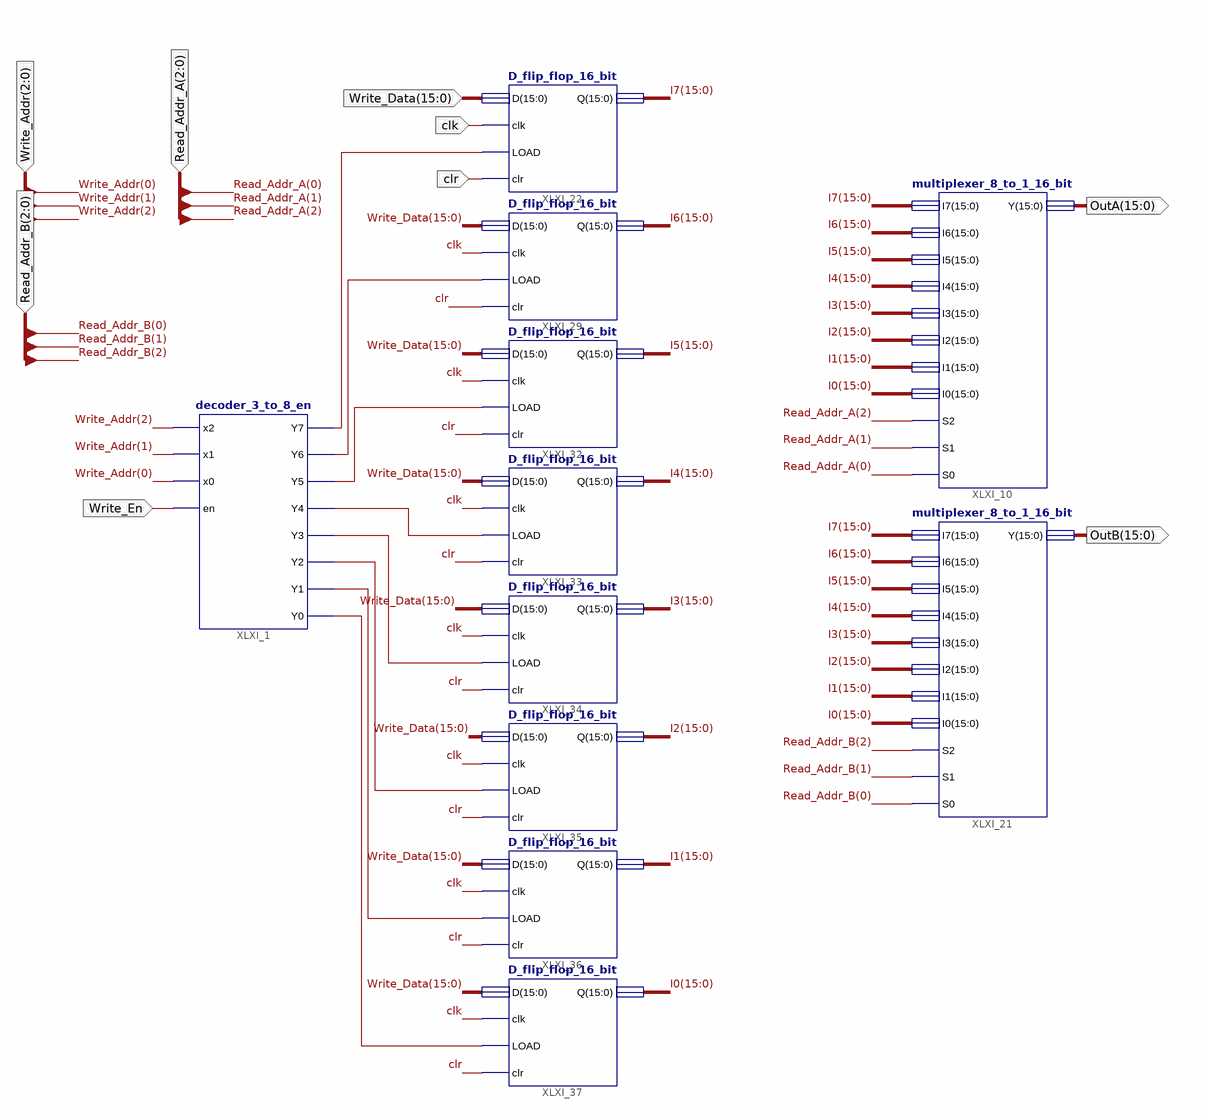
[diagram p0: schematic sheet 1]
// Xilinx ISE schematic register_file_16_bit.sch (virtex6) as structural Verilog: 11 symbols, 9 ports
module register_file_16_bit (
  input  Write_En,
  input  [2:0] Write_Addr,
  input  clk,
  input  [2:0] Read_Addr_A,
  input  [2:0] Read_Addr_B,
  input  [15:0] Write_Data,
  input  clr,
  output [15:0] OutA,
  output [15:0] OutB
);

  wire XLXN_101, XLXN_102, XLXN_103, XLXN_104, XLXN_105, XLXN_107, XLXN_109, XLXN_111;
  wire [15:0] I0, I1, I2, I3, I4, I5, I6, I7;

  decoder_3_to_8_en XLXI_1 (
    .en(Write_En), .x0(Write_Addr[0]), .x1(Write_Addr[1]), .x2(Write_Addr[2]), .Y0(XLXN_111), .Y1(XLXN_109),
    .Y2(XLXN_107), .Y3(XLXN_105), .Y4(XLXN_104), .Y5(XLXN_103), .Y6(XLXN_102), .Y7(XLXN_101));
  multiplexer_8_to_1_16_bit XLXI_10 (
    .I0(I0), .I1(I1), .I2(I2), .I3(I3), .I4(I4), .I5(I5), .I6(I6), .I7(I7), .S0(Read_Addr_A[0]),
    .S1(Read_Addr_A[1]), .S2(Read_Addr_A[2]), .Y(OutA));
  multiplexer_8_to_1_16_bit XLXI_21 (
    .I0(I0), .I1(I1), .I2(I2), .I3(I3), .I4(I4), .I5(I5), .I6(I6), .I7(I7), .S0(Read_Addr_B[0]),
    .S1(Read_Addr_B[1]), .S2(Read_Addr_B[2]), .Y(OutB));
  D_flip_flop_16_bit XLXI_22 (.clk(clk), .clr(clr), .D(Write_Data), .LOAD(XLXN_101), .Q(I7));
  D_flip_flop_16_bit XLXI_29 (.clk(clk), .clr(clr), .D(Write_Data), .LOAD(XLXN_102), .Q(I6));
  D_flip_flop_16_bit XLXI_32 (.clk(clk), .clr(clr), .D(Write_Data), .LOAD(XLXN_103), .Q(I5));
  D_flip_flop_16_bit XLXI_33 (.clk(clk), .clr(clr), .D(Write_Data), .LOAD(XLXN_104), .Q(I4));
  D_flip_flop_16_bit XLXI_34 (.clk(clk), .clr(clr), .D(Write_Data), .LOAD(XLXN_105), .Q(I3));
  D_flip_flop_16_bit XLXI_35 (.clk(clk), .clr(clr), .D(Write_Data), .LOAD(XLXN_107), .Q(I2));
  D_flip_flop_16_bit XLXI_36 (.clk(clk), .clr(clr), .D(Write_Data), .LOAD(XLXN_109), .Q(I1));
  D_flip_flop_16_bit XLXI_37 (.clk(clk), .clr(clr), .D(Write_Data), .LOAD(XLXN_111), .Q(I0));
endmodule
